# Altium schematic sheet 1_Interface.SchDoc: DB_ADCS Interface
size A3; DrawnBy: Augusto Cezar Boldori Vassoler; Revision: V1.0; SheetNumber: 1; SheetTotal: 6; Project: DB_ADCS.PrjPCB
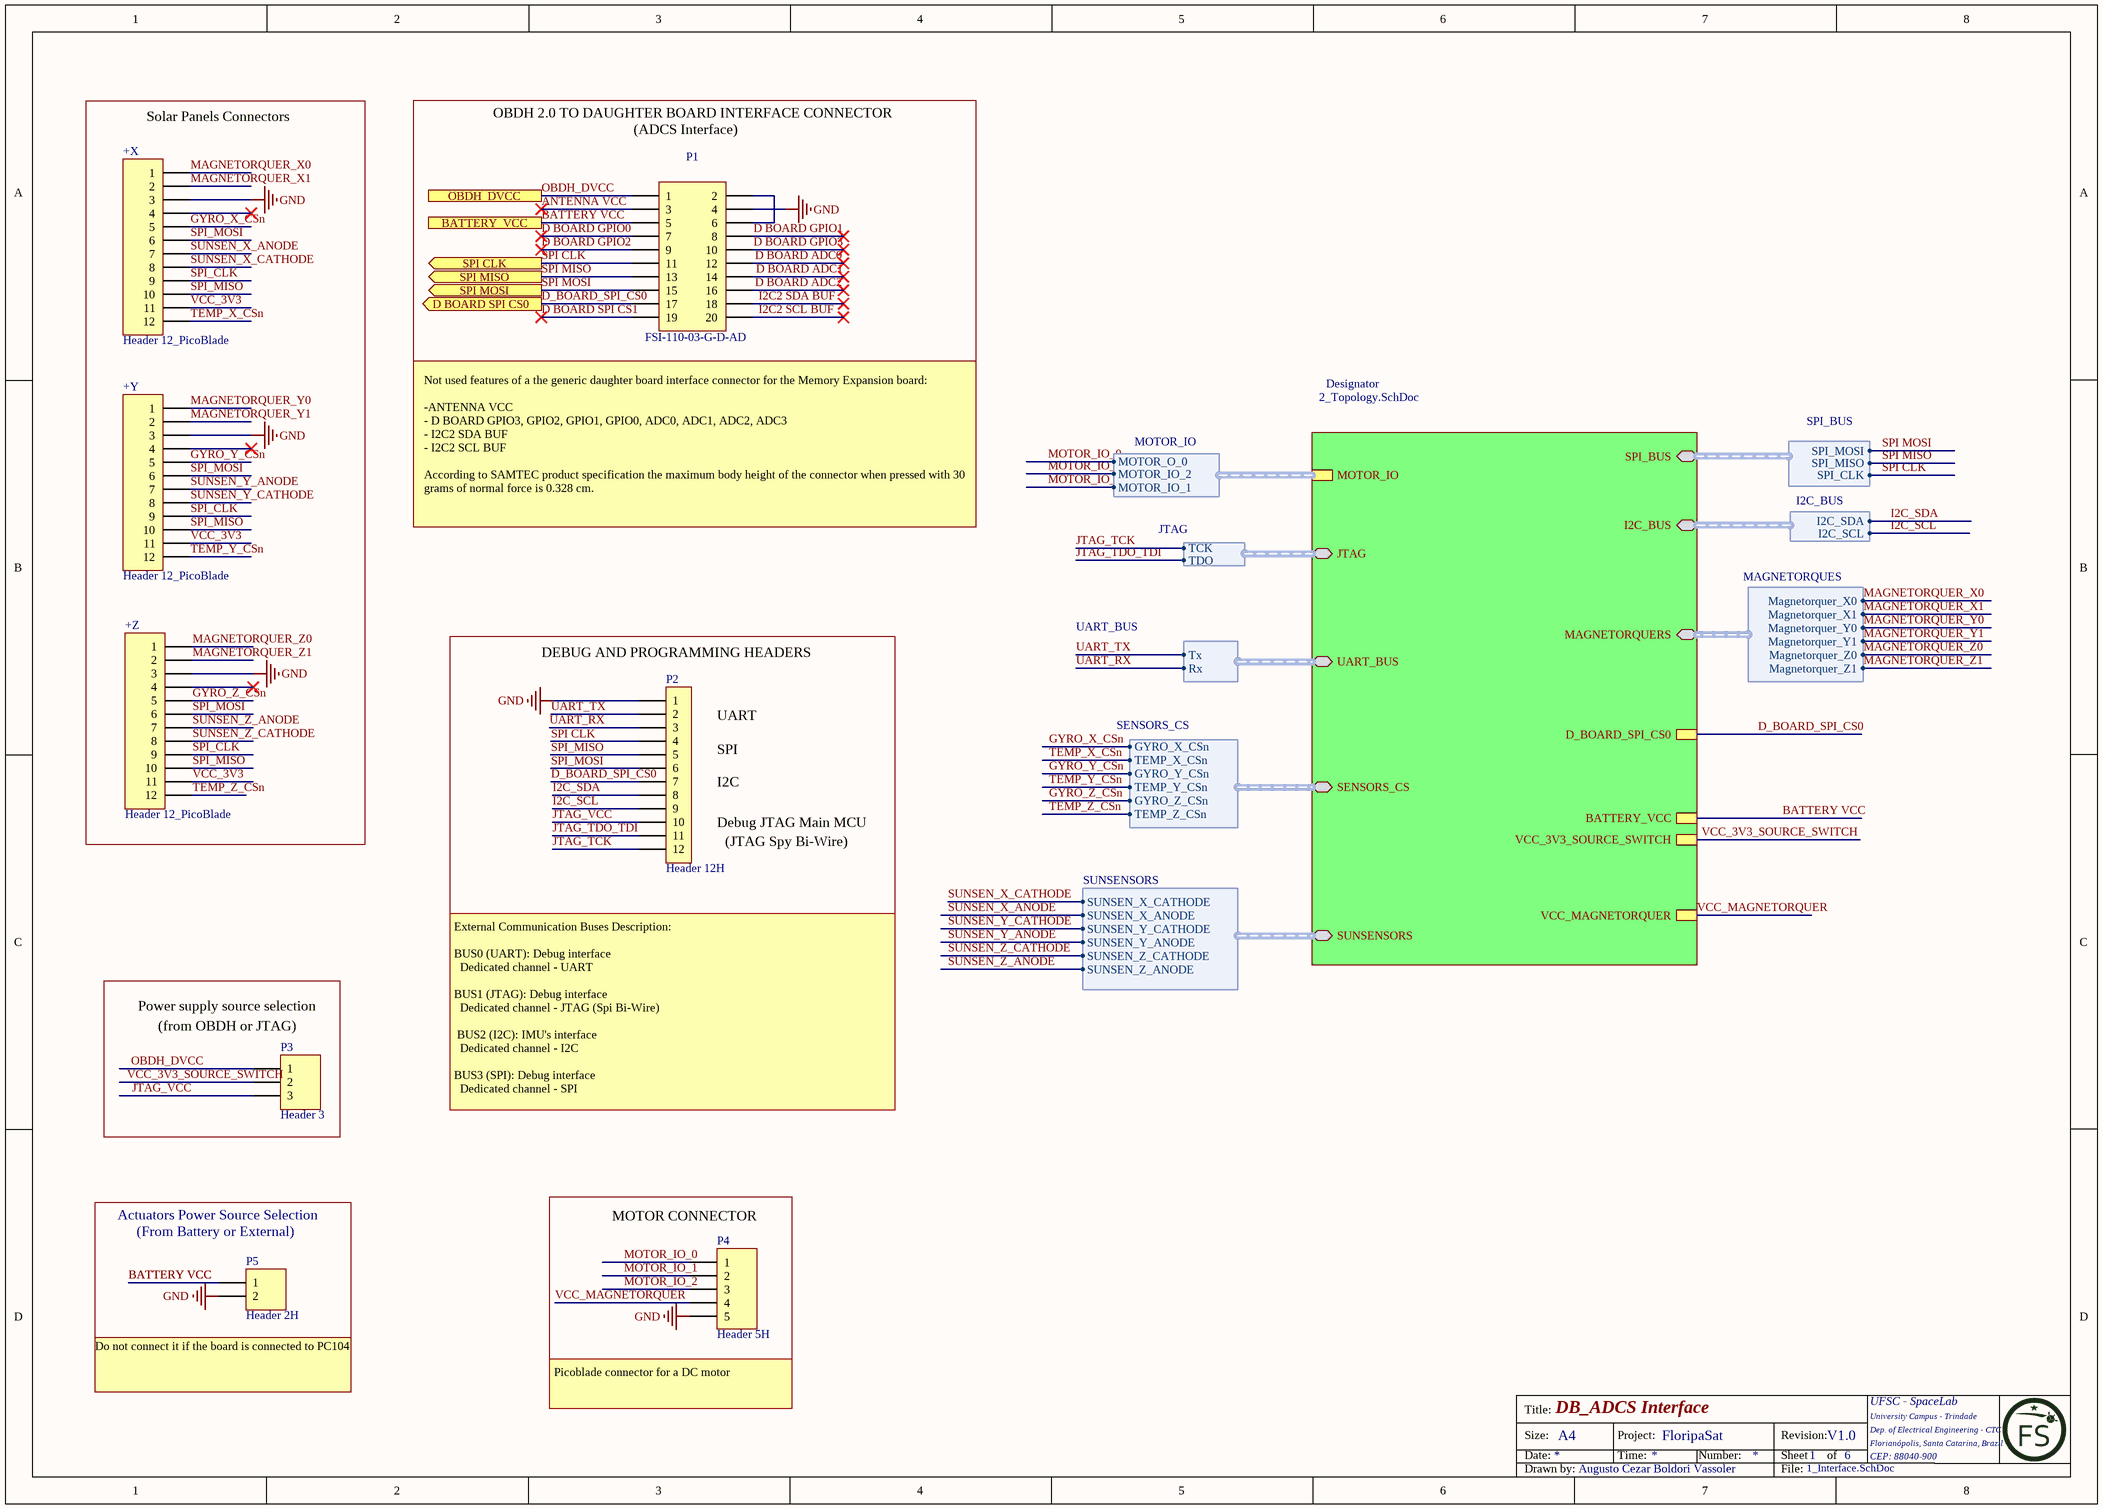
[diagram p0: 1_Interface.SchDoc]

## Parts
+X  Header 12_PicoBlade  [HDR12 PicoBlade - duplicate]
+Y  Header 12_PicoBlade  [HDR12 PicoBlade - duplicate]
+Z  Header 12_PicoBlade  [HDR12 PicoBlade - duplicate]
P1  FSI-110-03-G-D-AD  [Mating FSI-110-03-G-D-AD]
P2  Header 12H  [61301211021]
P3  Header 3  [HDR1X3]
P4  Header 5H  [MOLX-53398-0571-5_V]
P5  Header 2H  [HDR1X2H]

## Blocks framed on the sheet
Solar Panels Connectors: +X +Y +Z
MOTOR CONNECTOR: P4

## Sub-sheets
Designator = 2_Topology.SchDoc: JTAG (bidir, harness JTAG), UART_BUS (bidir, harness UART_BUS), SENSORS_CS (bidir, harness SENSORS_CS), SUNSENSORS (bidir, harness SUNSENSORS), MAGNETORQUERS (bidir, harness MAGNETORQUES), BATTERY_VCC, I2C_BUS (bidir, harness I2C_BUS), SPI_BUS (bidir, harness SPI_BUS), VCC_3V3_SOURCE_SWITCH, D_BOARD_SPI_CS0, MOTOR_IO (harness MOTOR_IO), VCC_MAGNETORQUER

## Ports
BATTERY_VCC, D BOARD SPI CS0 (out), OBDH_DVCC, SPI CLK (out), SPI MISO (out), SPI MOSI (out)

## Harnesses
JTAG: TDO, TCK
UART_BUS: Rx, Tx
SENSORS_CS: GYRO_X_CSn, TEMP_X_CSn, GYRO_Y_CSn, TEMP_Y_CSn, GYRO_Z_CSn, TEMP_Z_CSn
SUNSENSORS: SUNSEN_Z_ANODE, SUNSEN_Z_CATHODE, SUNSEN_Y_ANODE, SUNSEN_Y_CATHODE, SUNSEN_X_ANODE, SUNSEN_X_CATHODE
MAGNETORQUES: Magnetorquer_X0, Magnetorquer_X1, Magnetorquer_Y0, Magnetorquer_Y1, Magnetorquer_Z0, Magnetorquer_Z1
I2C_BUS: I2C_SDA, I2C_SCL
SPI_BUS: SPI_CLK, SPI_MISO, SPI_MOSI
MOTOR_IO: MOTOR_O_0, MOTOR_IO_1, MOTOR_IO_2

## Nets
GND: +X.3 +Y.3 +Z.3 P1.4 P2.1 P4.5 P5.2
ANTENNA VCC: P1.3
BATTERY VCC: P1.5 P5.1 ; port BATTERY_VCC, sheet Designator/BATTERY_VCC
D BOARD ADC0: P1.12
D BOARD ADC1: P1.14
D BOARD ADC2: P1.16
D BOARD GPIO0: P1.7
D BOARD GPIO1: P1.8
D BOARD GPIO2: P1.9
D BOARD GPIO3: P1.10
D BOARD SPI CS1: P1.19
D_BOARD_SPI_CS0: P1.17 P2.7 ; port D BOARD SPI CS0, sheet Designator/D_BOARD_SPI_CS0
GYRO_X_CSn: +X.5 ; sheet Designator/SENSORS_CS.GYRO_X_CSn
GYRO_Y_CSn: +Y.5 ; sheet Designator/SENSORS_CS.GYRO_Y_CSn
GYRO_Z_CSn: +Z.5 ; sheet Designator/SENSORS_CS.GYRO_Z_CSn
I2C2 SCL BUF: P1.20
I2C2 SDA BUF: P1.18
I2C_SCL: P2.9 ; sheet Designator/I2C_BUS.I2C_SCL
I2C_SDA: P2.8 ; sheet Designator/I2C_BUS.I2C_SDA
JTAG_TCK: P2.12 ; sheet Designator/JTAG.TCK
JTAG_TDO_TDI: P2.11 ; sheet Designator/JTAG.TDO
JTAG_VCC: P2.10 P3.3
MAGNETORQUER_X0: +X.1 ; sheet Designator/MAGNETORQUERS.Magnetorquer_X0
MAGNETORQUER_X1: +X.2 ; sheet Designator/MAGNETORQUERS.Magnetorquer_X1
MAGNETORQUER_Y0: +Y.1 ; sheet Designator/MAGNETORQUERS.Magnetorquer_Y0
MAGNETORQUER_Y1: +Y.2 ; sheet Designator/MAGNETORQUERS.Magnetorquer_Y1
MAGNETORQUER_Z0: +Z.1 ; sheet Designator/MAGNETORQUERS.Magnetorquer_Z0
MAGNETORQUER_Z1: +Z.2 ; sheet Designator/MAGNETORQUERS.Magnetorquer_Z1
MOTOR_IO_0: P4.1 ; sheet Designator/MOTOR_IO.MOTOR_O_0
MOTOR_IO_1: P4.2 ; sheet Designator/MOTOR_IO.MOTOR_IO_2
MOTOR_IO_2: P4.3 ; sheet Designator/MOTOR_IO.MOTOR_IO_1
OBDH_DVCC: P1.1 P3.1 ; port OBDH_DVCC
SPI CLK: P1.11 P2.4 ; port SPI CLK, sheet Designator/SPI_BUS.SPI_CLK
SPI MISO: P1.13 ; port SPI MISO, sheet Designator/SPI_BUS.SPI_MISO
SPI MOSI: P1.15 ; port SPI MOSI, sheet Designator/SPI_BUS.SPI_MOSI
SPI_CLK: +X.9 +Y.9 +Z.9
SPI_MISO: +X.10 +Y.10 +Z.10 P2.5
SPI_MOSI: +X.6 +Y.6 +Z.6 P2.6
SUNSEN_X_ANODE: +X.7 ; sheet Designator/SUNSENSORS.SUNSEN_X_ANODE
SUNSEN_X_CATHODE: +X.8 ; sheet Designator/SUNSENSORS.SUNSEN_X_CATHODE
SUNSEN_Y_ANODE: +Y.7 ; sheet Designator/SUNSENSORS.SUNSEN_Y_ANODE
SUNSEN_Y_CATHODE: +Y.8 ; sheet Designator/SUNSENSORS.SUNSEN_Y_CATHODE
SUNSEN_Z_ANODE: +Z.7 ; sheet Designator/SUNSENSORS.SUNSEN_Z_ANODE
SUNSEN_Z_CATHODE: +Z.8 ; sheet Designator/SUNSENSORS.SUNSEN_Z_CATHODE
TEMP_X_CSn: +X.12 ; sheet Designator/SENSORS_CS.TEMP_X_CSn
TEMP_Y_CSn: +Y.12 ; sheet Designator/SENSORS_CS.TEMP_Y_CSn
TEMP_Z_CSn: +Z.12 ; sheet Designator/SENSORS_CS.TEMP_Z_CSn
UART_RX: P2.3 ; sheet Designator/UART_BUS.Rx
UART_TX: P2.2 ; sheet Designator/UART_BUS.Tx
VCC_3V3: +X.11 +Y.11 +Z.11
VCC_3V3_SOURCE_SWITCH: P3.2 ; sheet Designator/VCC_3V3_SOURCE_SWITCH
VCC_MAGNETORQUER: P4.4 ; sheet Designator/VCC_MAGNETORQUER
NetP1_2: P1.2 P1.6

Not connected (* = marked no-connect by the designer): +X 4*; +Y 4*; +Z 4*

## Notes on the sheet
- OBDH 2.0 TO DAUGHTER BOARD INTERFACE CONNECTOR
- (ADCS Interface)
- Not used features of a the generic daughter board interface connector for the Memory Expansion board:
  -ANTENNA VCC
  - D BOARD GPIO3, GPIO2, GPIO1, GPIO0, ADC0, ADC1, ADC2, ADC3
  - I2C2 SDA BUF
  - I2C2 SCL BUF
  According to SAMTEC product specification the maximum body height of the connector when pressed with 30 grams of normal force is 0.328 cm.
- (near P2) DEBUG AND PROGRAMMING HEADERS
- (near P2) UART
- (near P2) SPI
- (near P2) I2C
- (near P2) Debug JTAG Main MCU
- (JTAG Spy Bi-Wire)
- (near P3) Power supply source selection
- (near P3) (from OBDH or JTAG)
- External Communication Buses Description:
  BUS0 (UART): Debug interface
  Dedicated channel - UART
  BUS1 (JTAG): Debug interface
  Dedicated channel - JTAG (Spi Bi-Wire)
  BUS2 (I2C): IMU's interface
  Dedicated channel - I2C
  BUS3 (SPI): Debug interface
  Dedicated channel - SPI
- Actuators Power Source Selection
- (near P5) (From Battery or External)
- (near P5) Do not connect it if the board is connected to PC104
- (near P4) Picoblade connector for a DC motor
- Title:
- Size:
- Date:
- A4
- Project:
- Time:
- FloripaSat
- Number:
- Revision:
- Sheet
- of
- UFSC - SpaceLab
- University Campus - Trindade
- Dep. of Electrical Engineering - CTC
- Florianópolis, Santa Catarina, Brazil
- CEP: 88040-900
- Drawn by:
- File:

## Library data of the parts
+X +Y = Header 12_PicoBlade: Header, 12-Pin; PartNumber: 53398-1271; LatestRevisionDate: 17-Jul-2002; LatestRevisionNote: Re-released for DXP Platform.; Publisher: Altium Limited
+Z = Header 12_PicoBlade: Header, 12-Pin; PartNumber: 533981271; LatestRevisionDate: 17-Jul-2002; LatestRevisionNote: Re-released for DXP Platform.; Publisher: Altium Limited
P1 = FSI-110-03-G-D-AD: CONN STACKING 20POS SMD GOLD; Manufacturer: Samtec; Gender: Male; Number of Contacts: 20; Pitch: 1mm; Value: *; Partnumber: FSI-110-03-G-D-AD; ComponentLink1Description: https://www.digikey.com/product-detail/en/samtec-inc/FSI-110-03-G-D-AD/SAM9412-ND/6678149; ComponentLink1URL: https://www.digikey.com/product-detail/en/samtec-inc/FSI-110-03-G-D-AD/SAM9412-ND/6678149; ComponentLink2Description: https://br.mouser.com/ProductDetail/Samtec/FSI-110-03-G-D-AD?qs=sGAEpiMZZMvffgRu4KC1RxM6nKwEP14AvPoIU%2FGiIRnIunfAN0MvNQ%3D%3D; ComponentLink2URL: https://br.mouser.com/ProductDetail/Samtec/FSI-110-03-G-D-AD?qs=sGAEpiMZZMvffgRu4KC1RxM6nKwEP14AvPoIU%2FGiIRnIunfAN0MvNQ%3D%3D; ComponentLink3Description: http://www.samtec.com/ftppub/pdf/FSI_03.PDF?src-supplier=Avnet+Europe; ComponentLink3URL: http://www.samtec.com/ftppub/pdf/FSI_03.PDF?src-supplier=Avnet+Europe; Contact Material: Copper; Contact Plating: Gold; Manufacturer Part Number: FSI-110-03-G-D-AD; Mount: Surface Mount; Number of Rows: 2; Pricing 1: 1=6.6, 10=6.325, 25=5.7752, 50=5.5, 100=5.225, 250=4.675, 500=4.4, 1000=3.85, 2500=3.6575 (USD); Pricing 2: 1=6.59, 10=5.5, 100=4.68, 250=4.17, 500=3.84, 1000=3.6 (USD); Radiation Hardening: No; REACH SVHC: No SVHC; Stock 1: 100; Stock 2: 50; Supplier 1: Digi-Key; Supplier 2: Mouser; Supplier Part Number 1: SAM9412-ND; Supplier Part Number 2: 200-FSI11003GDAD; Termination: Solder
P2 = Header 12H: Header, 12; Manufacturer: Wurth Electronics; Number of Contacts: 12; Gender: Male; Connector Type: Male Pin; Pitch: 0.1inch; Supplier 1: Digi-Key; Supplier Part Number 1: 732-5343-ND; Manufacturer Part Number: 61301211021; RoHS: Yes; Category: Connectors; Stock 1: 973; Pricing 1: 1=0,90000, 10=0,76600, 25=0,63920, 50=0,53200, 100=0,48400, 500=0,44000 (USD); Mount: Through Hole; Contact Material: Copper; Color: Black; Contact Plating: Gold; Number of Rows: 1; Termination: Solder; Packaging: Bulk; Number of Positions: 12; Contact Mating Length: 0.236inch; REACH SVHC: Unknown; ComponentLink1URL: http://www.farnell.com/datasheets/1442172.pdf?src-supplier=Farnell; ComponentLink1Description: http://www.farnell.com/datasheets/1442172.pdf?src-supplier=Farnell; ComponentLink2URL: http://www.farnell.com/datasheets/1442172.pdf?src-supplier=Element14; ComponentLink2Description: http://www.farnell.com/datasheets/1442172.pdf?src-supplier=Element14; ComponentLink3URL: https://katalog.we-online.de/em/datasheet/6130xx11021.pdf?src-supplier=Digi-Key; ComponentLink3Description: https://katalog.we-online.de/em/datasheet/6130xx11021.pdf?src-supplier=Digi-Key; ComponentLink4URL: http://www.farnell.com/datasheets/1442172.pdf?src-supplier=Newark; ComponentLink4Description: http://www.farnell.com/datasheets/1442172.pdf?src-supplier=Newark
P3 = Header 3: Header, 3-Pin; LatestRevisionDate: 17-Jul-2002; LatestRevisionNote: Re-released for DXP Platform.; Publisher: Altium Limited
P4 = Header 5H_PicoBlade: Header,5-Pin,Right Angle; Manufacturer: Molex; Manufacturer Part Number: 53398-0571; Body Plating: Tin; Number of Contacts: 5; Current Rating: 1A; Voltage Rating: 125V; Gender: Male; Contact Resistance: 20mR; Insulation Resistance: 100MR; Pitch: 1.25mm; Glow Wire Compliant: Non-compliant; Supplier 1: Digi-Key; Supplier Part Number 1: WM7609CT-ND; RoHS: Yes; Category: Headers and Wire Housings; Stock 1: 468; Pricing 1: 1=1,32000, 10=1,15900, 100=0,99990, 500=0,81814 (USD); Mount: Surface Mount; Color: Natural; Contact Material: Bronze,Tin,Brass; Contact Plating: Tin; Housing Material: Nylon; Housing Color: Natural; Min Operating Temperature: -40°C; Max Operating Temperature: 85°C; Termination: Solder; Number of Rows: 1; Packaging: Tape and Reel; Number of Positions: 5; Package Quantity: 1000; Orientation: Vertical; Contact Gender: Male; Max Voltage Rating (AC): 125V; Voltage Rating (AC): 125V; Number of Circuits: 5; Working Voltage: 125V; Voltage Rating (DC): 125V; Lead Pitch: 1.25mm; Radiation Hardening: No; REACH SVHC: Unknown; Flammability Rating: UL94 V-0; Lead Free: Lead Free; ComponentLink1URL: https://datasheet.ciiva.com/16658/0533980571-pcb-headers-16658432.pdf?src-supplier=Avnet+Europe; ComponentLink1Description: https://datasheet.ciiva.com/16658/0533980571-pcb-headers-16658432.pdf?src-supplier=Avnet+Europe; ComponentLink2URL: https://datasheet.ciiva.com/7167/1626108-7167525.pdf?src-supplier=Newark; ComponentLink2Description: https://datasheet.ciiva.com/7167/1626108-7167525.pdf?src-supplier=Newark; ComponentLink3URL: https://datasheet.ciiva.com/7683/1632115-7683910.pdf?src-supplier=Element14; ComponentLink3Description: https://datasheet.ciiva.com/7683/1632115-7683910.pdf?src-supplier=Element14; ComponentLink4URL: https://datasheet.ciiva.com/11747/0900766b8078fc92-11747178.pdf?src-supplier=RSComponents; ComponentLink4Description: https://datasheet.ciiva.com/11747/0900766b8078fc92-11747178.pdf?src-supplier=RSComponents; ComponentLink5URL: https://datasheet.ciiva.com/22699/1841163-22699962.pdf?src-supplier=Element14; ComponentLink5Description: https://datasheet.ciiva.com/22699/1841163-22699962.pdf?src-supplier=Element14; ComponentLink6URL: https://datasheet.ciiva.com/5158/0533980571-pcb-headers-146486-5158303.pdf?src-supplier=Mouser; ComponentLink6Description: https://datasheet.ciiva.com/5158/0533980571-pcb-headers-146486-5158303.pdf?src-supplier=Mouser; ComponentLink7URL: https://datasheet.ciiva.com/14156/gf116833-116846-e-14156246.pdf?src-supplier=Distrelec; ComponentLink7Description: https://datasheet.ciiva.com/14156/gf116833-116846-e-14156246.pdf?src-supplier=Distrelec; ComponentLink8URL: https://datasheet.ciiva.com/46446/1626108-46446108.pdf?src-supplier=Element14; ComponentLink8Description: https://datasheet.ciiva.com/46446/1626108-46446108.pdf?src-supplier=Element14
P5 = Header 2H: Header, 2-Pin, Right Angle; LatestRevisionDate: 17-Jul-2002; LatestRevisionNote: Re-released for DXP Platform.; Publisher: Altium Limited